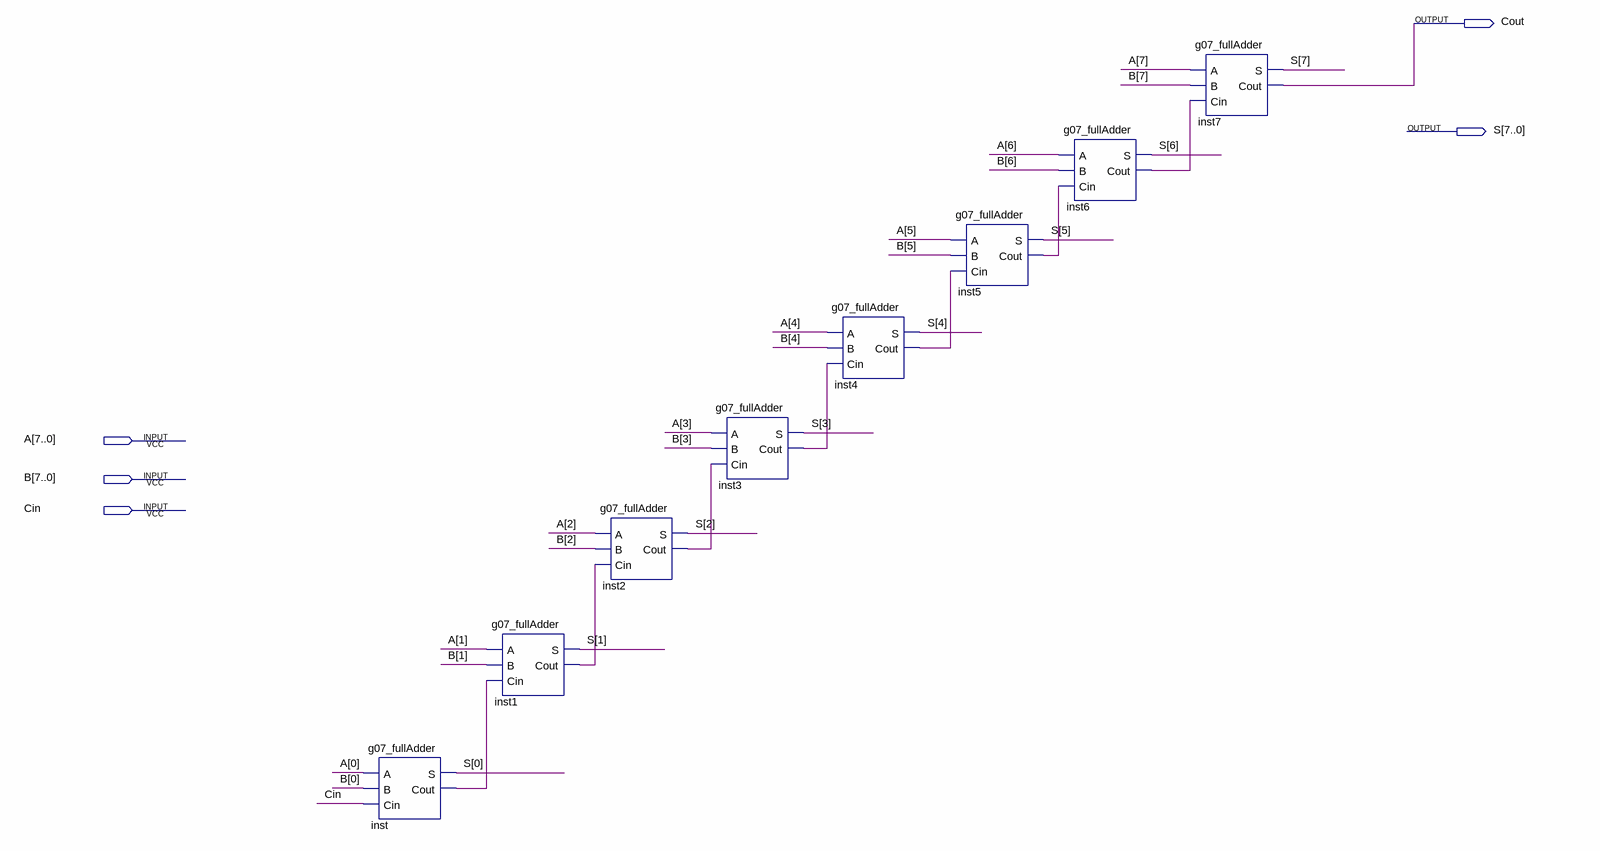
[diagram p0: schematic sheet]
// Quartus schematic g07_adder.bdf as structural Verilog: 8 symbols, 5 pins
module g07_adder (
  input  [7:0] A,
  input  [7:0] B,
  input  Cin,
  output Cout,
  output [7:0] S
);

  wire inst1_cout, inst2_cout, inst3_cout, inst4_cout, inst5_cout, inst6_cout, inst_cout;

  g07_fullAdder inst (.A(A[0]), .B(B[0]), .Cin(Cin), .S(S[0]), .Cout(inst_cout));
  g07_fullAdder inst1 (.A(A[1]), .B(B[1]), .Cin(inst_cout), .S(S[1]), .Cout(inst1_cout));
  g07_fullAdder inst2 (.A(A[2]), .B(B[2]), .Cin(inst1_cout), .S(S[2]), .Cout(inst2_cout));
  g07_fullAdder inst3 (.A(A[3]), .B(B[3]), .Cin(inst2_cout), .S(S[3]), .Cout(inst3_cout));
  g07_fullAdder inst4 (.A(A[4]), .B(B[4]), .Cin(inst3_cout), .S(S[4]), .Cout(inst4_cout));
  g07_fullAdder inst5 (.A(A[5]), .B(B[5]), .Cin(inst4_cout), .S(S[5]), .Cout(inst5_cout));
  g07_fullAdder inst6 (.A(A[6]), .B(B[6]), .Cin(inst5_cout), .S(S[6]), .Cout(inst6_cout));
  g07_fullAdder inst7 (.A(A[7]), .B(B[7]), .Cin(inst6_cout), .S(S[7]), .Cout(Cout));
endmodule
